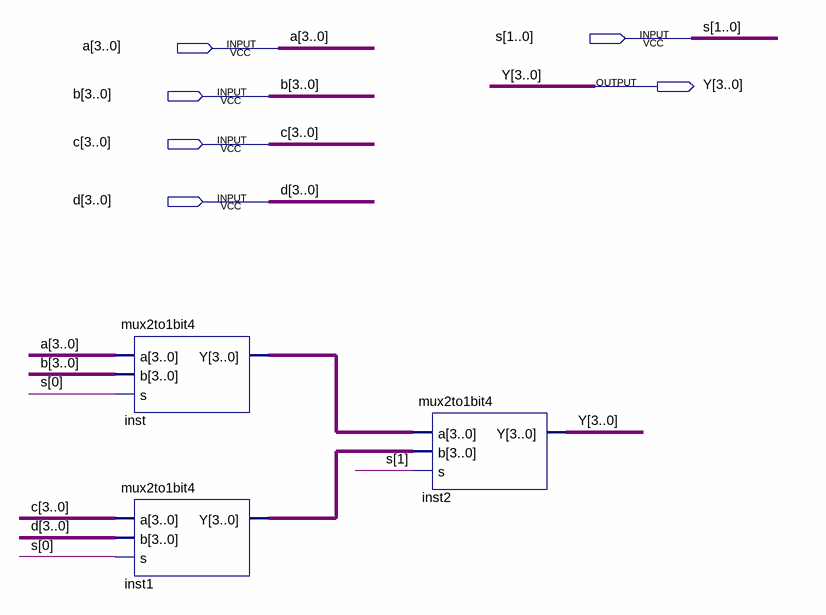
[diagram p0: schematic sheet]
// Quartus schematic mux4to1bit4.bdf as structural Verilog: 3 symbols, 6 pins
module mux4to1bit4 (
  input  [1:0] s,
  input  [3:0] a,
  input  [3:0] b,
  input  [3:0] c,
  input  [3:0] d,
  output [3:0] Y
);

  wire [3:0] inst1_y, inst_y;

  mux2to1bit4 inst (.a(a), .b(b), .s(s[0]), .Y(inst_y));
  mux2to1bit4 inst1 (.a(c), .b(d), .s(s[0]), .Y(inst1_y));
  mux2to1bit4 inst2 (.a(inst_y), .b(inst1_y), .s(s[1]), .Y(Y));
endmodule
